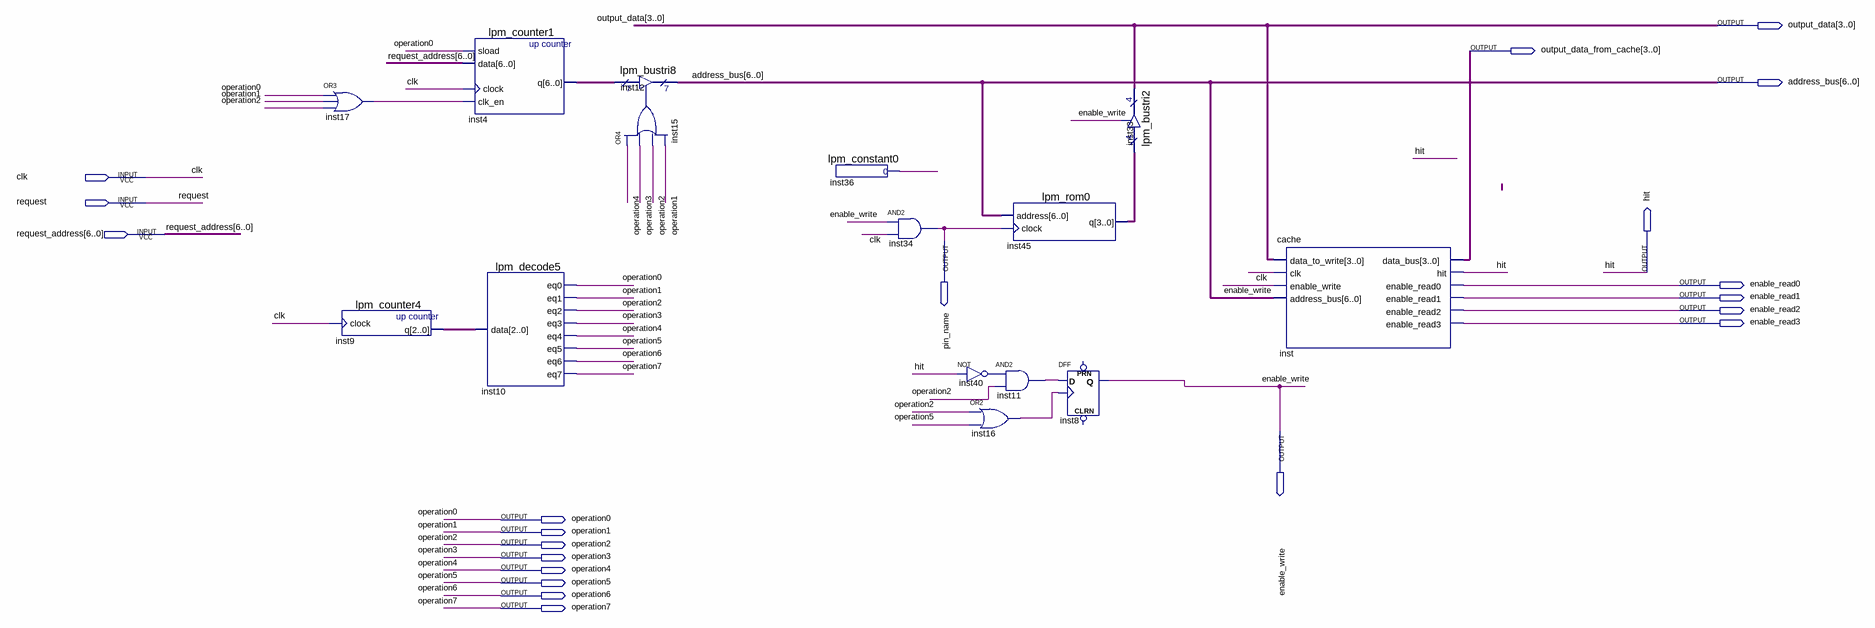
[diagram p0: schematic sheet]
// Quartus schematic LAB_67.bdf as structural Verilog: 15 symbols, 21 pins
module LAB_67 (
  input  clk,
  input  request,
  input  [6:0] request_address,
  output [3:0] output_data,
  output [3:0] output_data_from_cache,
  output [6:0] address_bus,
  output pin_name,
  output hit,
  output enable_read0,
  output enable_read1,
  output enable_read2,
  output enable_read3,
  output enable_write,
  output operation0,
  output operation1,
  output operation2,
  output operation3,
  output operation4,
  output operation5,
  output operation6,
  output operation7
);

  wire inst11_out, inst15_out, inst16_out, inst17_out, inst36_result, inst40_out;
  wire [2:0] inst9_q;
  wire [3:0] inst45_q;
  wire [6:0] inst4_q;

  or inst17 (inst17_out, operation0, operation1, operation2);
  lpm_counter4 inst9 (.clock(clk), .q(inst9_q));
  lpm_counter1 inst4 (.sload(operation0), .data(request_address), .clock(clk), .clk_en(inst17_out), .q(inst4_q));
  lpm_decode5 inst10 (
    .data(inst9_q), .eq0(operation0), .eq1(operation1), .eq2(operation2), .eq3(operation3), .eq4(operation4),
    .eq5(operation5), .eq6(operation6), .eq7(operation7));
  lpm_bustri8 inst12 (.enabledt(inst15_out), .data(inst4_q), .tridata(address_bus));
  or inst15 (inst15_out, operation4, operation3, operation2, operation1);
  lpm_constant0 inst36 (.result(inst36_result));
  and inst34 (pin_name, enable_write, clk);
  not inst40 (inst40_out, hit);
  or inst16 (inst16_out, operation2, operation5);
  lpm_rom0 inst45 (.address(address_bus), .clock(pin_name), .q(inst45_q));
  and inst11 (inst11_out, inst40_out, operation2);
  DFF inst8 (.CLK(inst16_out), .D(inst11_out), .Q(enable_write));  // open: CLRN, PRN
  lpm_bustri2 inst33 (.enabledt(enable_write), .data(inst45_q), .tridata(output_data));
  cache inst (
    .data_to_write(output_data), .clk(clk), .enable_write(enable_write), .address_bus(address_bus),
    .data_bus(output_data_from_cache), .hit(hit), .enable_read0(enable_read0), .enable_read1(enable_read1),
    .enable_read2(enable_read2), .enable_read3(enable_read3));
endmodule
